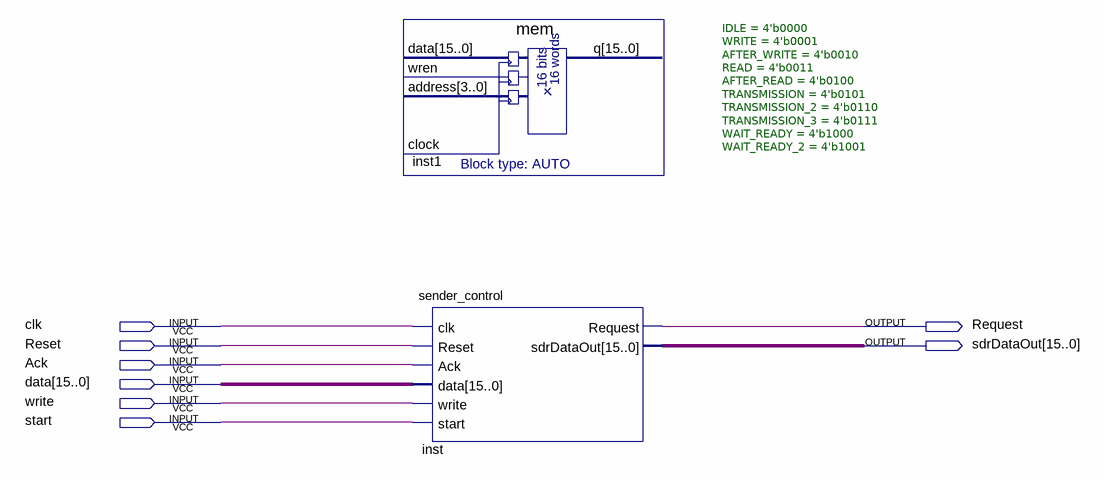
[diagram p0: schematic sheet]
// Quartus schematic teste_mem.bdf as structural Verilog: 2 symbols, 8 pins
module teste_mem (
  input  clk,
  input  Reset,
  input  Ack,
  input  [15:0] data,
  input  write,
  input  start,
  output Request,
  output [15:0] sdrDataOut
);

  mem inst1 ();  // open: data, wren, address, clock, q
  sender_control #(.IDLE(4'b0000), .WRITE(4'b0001), .AFTER_WRITE(4'b0010), .READ(4'b0011), .AFTER_READ(4'b0100), .TRANSMISSION(4'b0101), .TRANSMISSION_2(4'b0110), .TRANSMISSION_3(4'b0111), .WAIT_READY(4'b1000), .WAIT_READY_2(4'b1001)) inst (
    .clk(clk), .Reset(Reset), .Ack(Ack), .data(data), .write(write), .start(start), .Request(Request),
    .sdrDataOut(sdrDataOut));
endmodule
